# EAGLE design hector_monstertruck_shield (EAGLE 7.5.0)

## Sheet 1 of 2
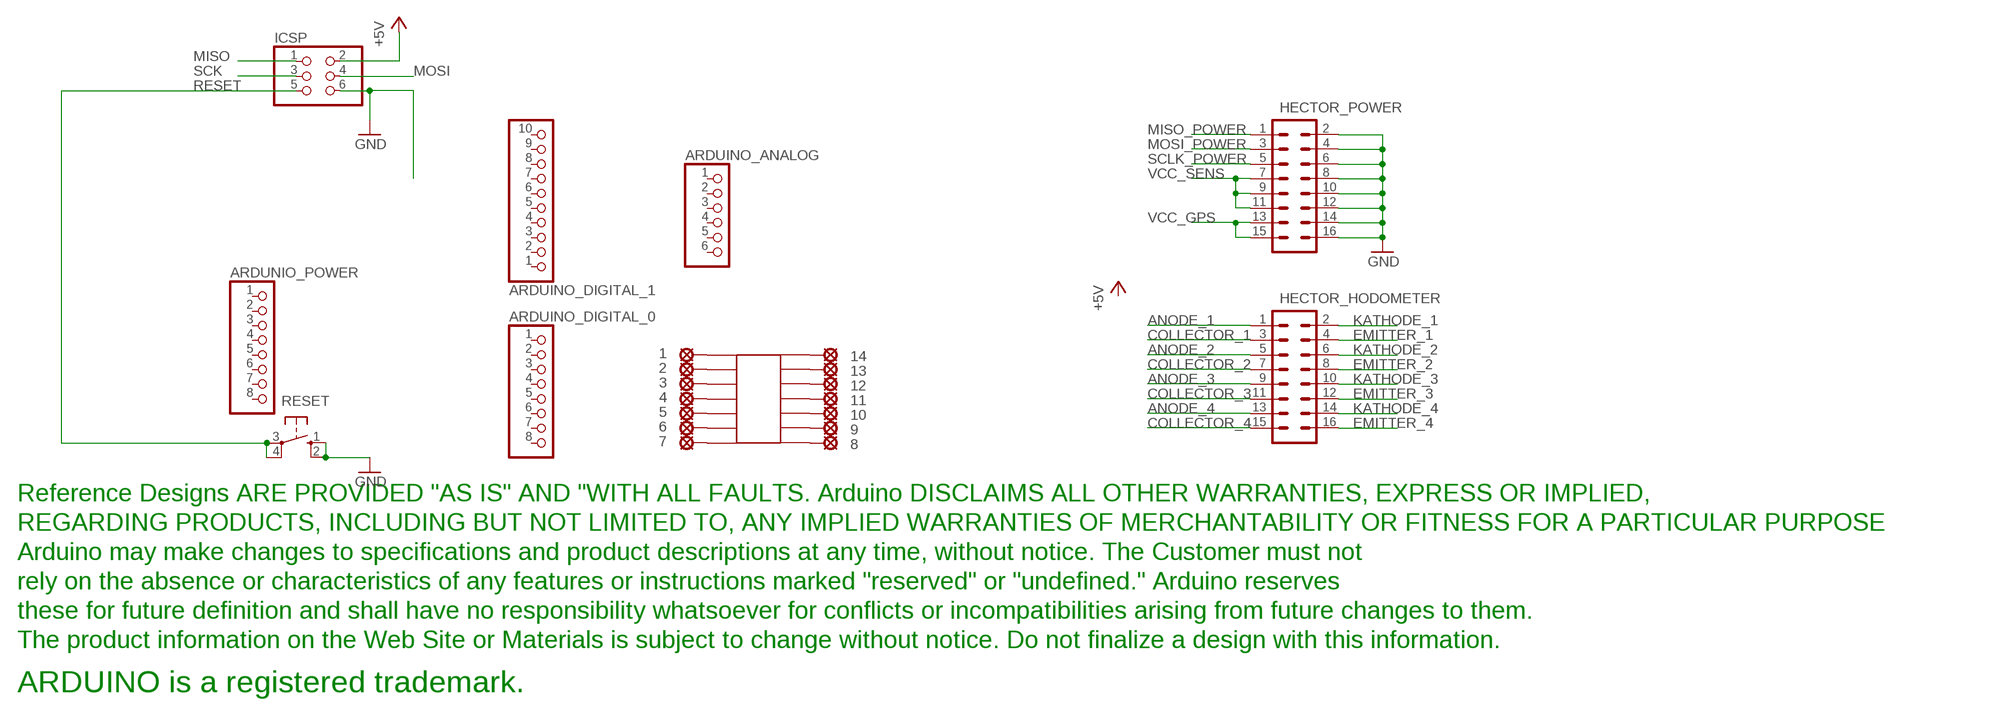
[diagram p0: schematic, sheet 1]

### Parts
1  LSP10  [LSP10]
2  LSP10  [LSP10]
3  LSP10  [LSP10]
4  LSP10  [LSP10]
5  LSP10  [LSP10]
6  LSP10  [LSP10]
7  LSP10  [LSP10]
8  LSP10  [LSP10]
9  LSP10  [LSP10]
10  LSP10  [LSP10]
11  LSP10  [LSP10]
12  LSP10  [LSP10]
13  LSP10  [LSP10]
14  LSP10  [LSP10]
ARDUINO_ANALOG  PINHD-1X6  [1X06]
ARDUINO_DIGITAL_0  PINHD-1X8TH  [1X08-TH]
ARDUINO_DIGITAL_1  PINHD-1X10TH  [1X10-TH]
ARDUNIO_POWER  PINHD-1X8TH  [1X08-TH]
HECTOR_HODOMETER  M08X2  [2X8]
HECTOR_POWER  M08X2  [2X8]
IC2  SMD-14  [SO-14NMW]
ICSP  PINHD-2X3  [2X03]
RESET  10-XX  [B3F-10XX]
U$1  DISCLAIMER  [DISCLAIMER]

### Nets
+5V: ICSP.2 ; also sheet 2
ANODE_1: HECTOR_HODOMETER.1
ANODE_2: HECTOR_HODOMETER.5
ANODE_3: HECTOR_HODOMETER.9
ANODE_4: HECTOR_HODOMETER.13
COLLECTOR_1: HECTOR_HODOMETER.3
COLLECTOR_2: HECTOR_HODOMETER.7
COLLECTOR_3: HECTOR_HODOMETER.11
COLLECTOR_4: HECTOR_HODOMETER.15
EMITTER_1: HECTOR_HODOMETER.4
EMITTER_2: HECTOR_HODOMETER.8
EMITTER_3: HECTOR_HODOMETER.12
EMITTER_4: HECTOR_HODOMETER.16
GND: HECTOR_POWER.2 HECTOR_POWER.4 HECTOR_POWER.6 HECTOR_POWER.8 HECTOR_POWER.10 HECTOR_POWER.12 HECTOR_POWER.14 HECTOR_POWER.16 ICSP.6 RESET.1(S) RESET.2(S1) ; also sheet 2
KATHODE_1: HECTOR_HODOMETER.2
KATHODE_2: HECTOR_HODOMETER.6
KATHODE_3: HECTOR_HODOMETER.10
KATHODE_4: HECTOR_HODOMETER.14
MISO: ICSP.1
MISO_POWER: HECTOR_POWER.1
MOSI: ICSP.4
MOSI_POWER: HECTOR_POWER.3
N$24: 14.MP IC2.P$14
N$97: 13.MP IC2.P$13
N$98: 12.MP IC2.P$12
N$99: 11.MP IC2.P$11
N$100: 10.MP IC2.P$10
N$101: 9.MP IC2.P$9
N$102: 8.MP IC2.P$8
N$103: 7.MP IC2.P$7
N$104: 6.MP IC2.P$6
N$109: 5.MP IC2.P$5
N$110: 3.MP IC2.P$3
N$111: 2.MP IC2.P$2
N$112: 1.MP IC2.P$1
N$113: 4.MP IC2.P$4
RESET: ICSP.5 RESET.3(P) RESET.4(P1)
SCK: ICSP.3
SCLK_POWER: HECTOR_POWER.5
VCC_GPS: HECTOR_POWER.13 HECTOR_POWER.15
VCC_SENS: HECTOR_POWER.7 HECTOR_POWER.9 HECTOR_POWER.11
Unconnected: ARDUINO_ANALOG.1 ARDUINO_ANALOG.2 ARDUINO_ANALOG.3 ARDUINO_ANALOG.4 ARDUINO_ANALOG.5 ARDUINO_ANALOG.6 ARDUINO_DIGITAL_0.1 ARDUINO_DIGITAL_0.2 ARDUINO_DIGITAL_0.3 ARDUINO_DIGITAL_0.4 ARDUINO_DIGITAL_0.5 ARDUINO_DIGITAL_0.6 ARDUINO_DIGITAL_0.7 ARDUINO_DIGITAL_0.8 ARDUINO_DIGITAL_1.1 ARDUINO_DIGITAL_1.2 ARDUINO_DIGITAL_1.3 ARDUINO_DIGITAL_1.4 ARDUINO_DIGITAL_1.5 ARDUINO_DIGITAL_1.6 ARDUINO_DIGITAL_1.7 ARDUINO_DIGITAL_1.8 ARDUINO_DIGITAL_1.9 ARDUINO_DIGITAL_1.10 ARDUNIO_POWER.1 ARDUNIO_POWER.2 ARDUNIO_POWER.3 ARDUNIO_POWER.4 ARDUNIO_POWER.5 ARDUNIO_POWER.6 ARDUNIO_POWER.7 ARDUNIO_POWER.8

## Sheet 2 of 2
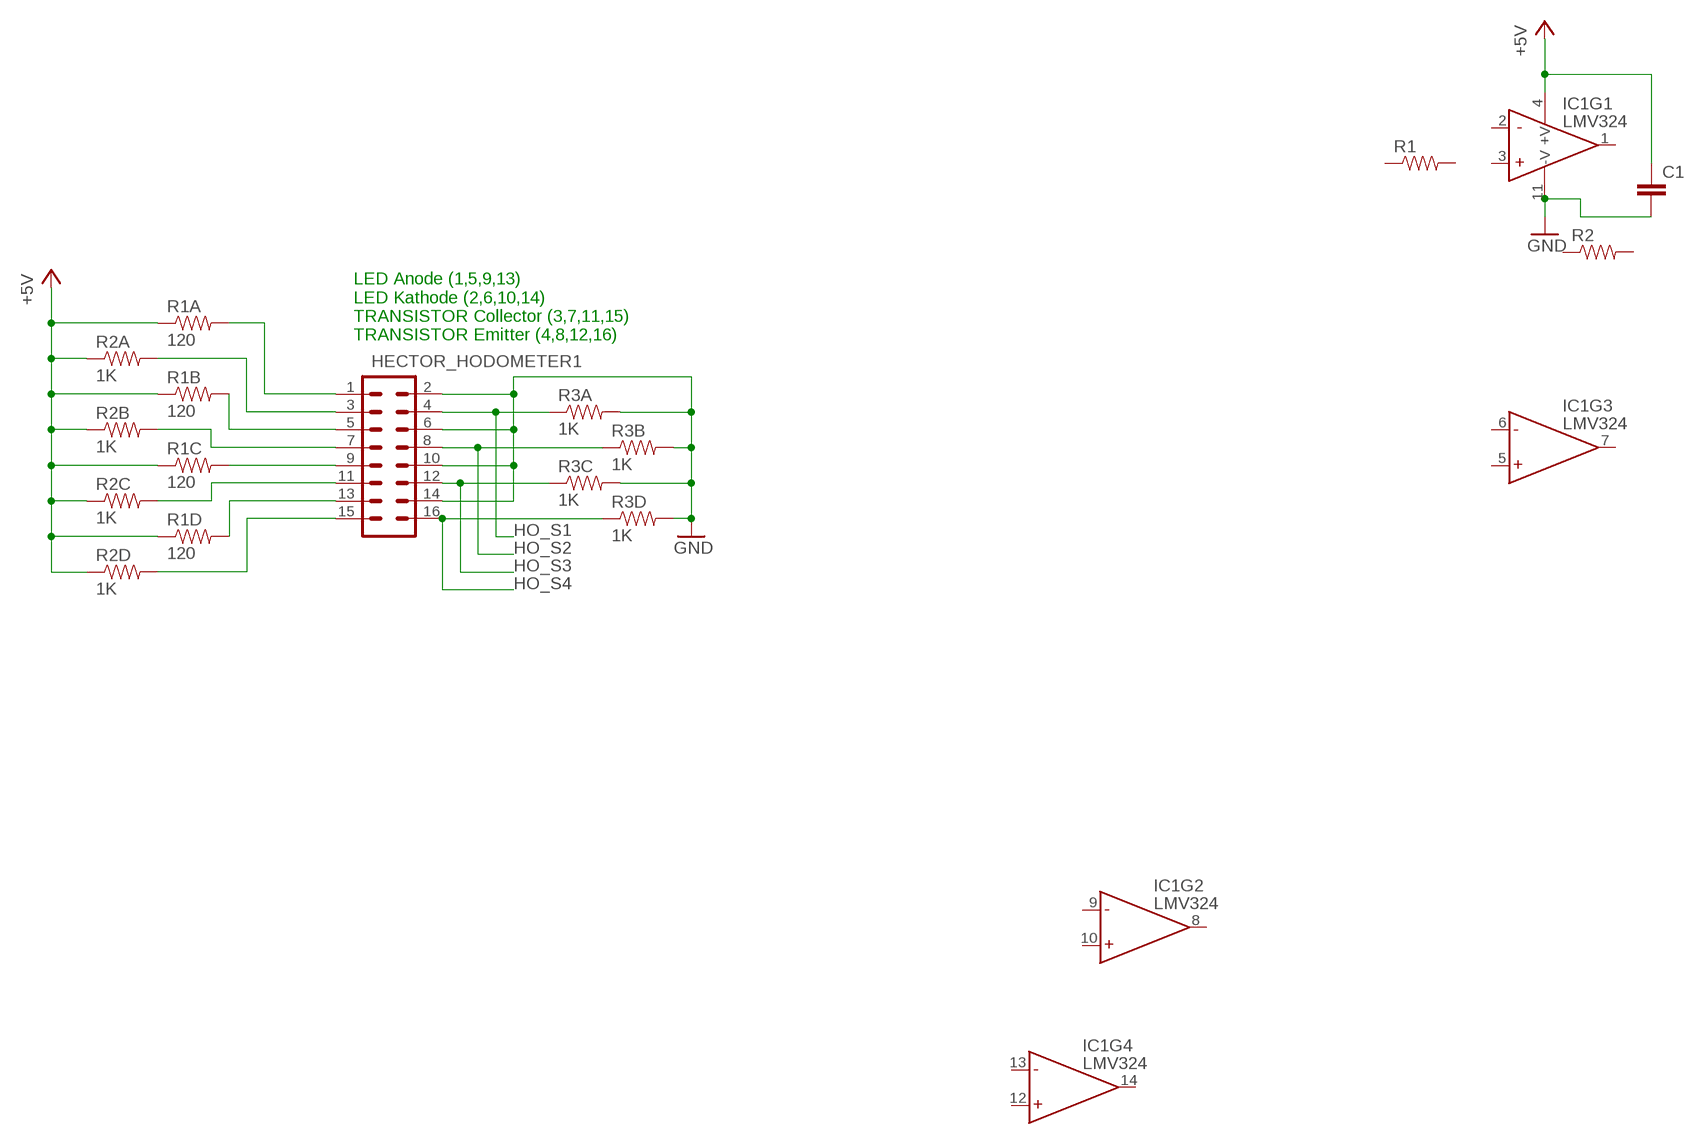
[diagram p1: schematic, sheet 2]

### Parts
C1  CAPPTH  [CAP-PTH-SMALL]
HECTOR_HODOMETER1  M08X2  [2X8]
IC1  LMV324  [SO014]
R1  RESISTORPTH-1/4W  [AXIAL-0.4]
R1A  120  RESISTORPTH-1/4W  [AXIAL-0.4]
R1B  120  RESISTORPTH-1/4W  [AXIAL-0.4]
R1C  120  RESISTORPTH-1/4W  [AXIAL-0.4]
R1D  120  RESISTORPTH-1/4W  [AXIAL-0.4]
R2  RESISTORPTH-1/4W  [AXIAL-0.4]
R2A  1K  RESISTORPTH-1/4W  [AXIAL-0.4]
R2B  1K  RESISTORPTH-1/4W  [AXIAL-0.4]
R2C  1K  RESISTORPTH-1/4W  [AXIAL-0.4]
R2D  1K  RESISTORPTH-1/4W  [AXIAL-0.4]
R3A  1K  RESISTORPTH-1/4W  [AXIAL-0.4]
R3B  1K  RESISTORPTH-1/4W  [AXIAL-0.4]
R3C  1K  RESISTORPTH-1/4W  [AXIAL-0.4]
R3D  1K  RESISTORPTH-1/4W  [AXIAL-0.4]

### Nets
+5V: C1.1 IC1.4(+V) R1A.P$1 R1B.P$1 R1C.P$1 R1D.P$1 R2A.P$1 R2B.P$1 R2C.P$1 R2D.P$1 ; also sheet 1
AN_1: HECTOR_HODOMETER1.1 R1A.P$2
AN_2: HECTOR_HODOMETER1.5 R1B.P$2
AN_3: HECTOR_HODOMETER1.9 R1C.P$2
AN_4: HECTOR_HODOMETER1.13 R1D.P$2
CO_1: HECTOR_HODOMETER1.3 R2A.P$2
CO_2: HECTOR_HODOMETER1.7 R2B.P$2
CO_3: HECTOR_HODOMETER1.11 R2C.P$2
CO_4: HECTOR_HODOMETER1.15 R2D.P$2
GND: C1.2 HECTOR_HODOMETER1.2 HECTOR_HODOMETER1.6 HECTOR_HODOMETER1.10 HECTOR_HODOMETER1.14 IC1.11(-V) R3A.P$2 R3B.P$2 R3C.P$2 R3D.P$2 ; also sheet 1
HO_S1: HECTOR_HODOMETER1.4 R3A.P$1
HO_S2: HECTOR_HODOMETER1.8 R3B.P$1
HO_S3: HECTOR_HODOMETER1.12 R3C.P$1
HO_S4: HECTOR_HODOMETER1.16 R3D.P$1
Unconnected: IC1.1(OUT) IC1.2(-IN) IC1.3(+IN) IC1.5(+IN) IC1.6(-IN) IC1.7(OUT) IC1.8(OUT) IC1.9(-IN) IC1.10(+IN) IC1.12(+IN) IC1.13(-IN) IC1.14(OUT) R1.P$1 R1.P$2 R2.P$1 R2.P$2

### Notes on the sheet
- LED Anode (1,5,9,13) 
  LED Kathode (2,6,10,14)
  TRANSISTOR Collector (3,7,11,15)
  TRANSISTOR Emitter (4,8,12,16)

## Library data of the parts
1-14 = SmartPrj:LSP10: SOLDER PAD drill 1.0 mm, distributor Buerklin, 12H555
ARDUINO_ANALOG = pinhead:PINHD-1X6: PIN HEADER
ARDUINO_DIGITAL_0 ARDUNIO_POWER = SmartPrj:PINHD-1X8: PIN HEADER
ARDUINO_DIGITAL_1 = SmartPrj:PINHD-1X10: PIN HEADER
C1 = SparkFun-Capacitors:CAP: Capacitor Standard 0603 ceramic capacitor, and 0.1" leaded capacitor.
HECTOR_HODOMETER HECTOR_HODOMETER1 HECTOR_POWER = SparkFun-Connectors:M08X2: .1" headers, two rows of 8 each
IC1 = SparkFun-AnalogIC:LMV324: Jellybean quad op-amp; PROD_ID: IC-08227
IC2 = carduino:SMD-14
ICSP = SmartPrj:PINHD-2X3: PIN HEADER
R1 R1A R1B R1C R1D R2 R2A R2B R2C R2D R3A R3B R3C R3D = SparkFun-Resistors:RESISTOR: Resistor Basic schematic elements and footprints for 0603, 1206, and PTH resistors.
RESET = switch-omron:10-XX: OMRON SWITCH
U$1 = SmartPrj:DISCLAIMER

## Board
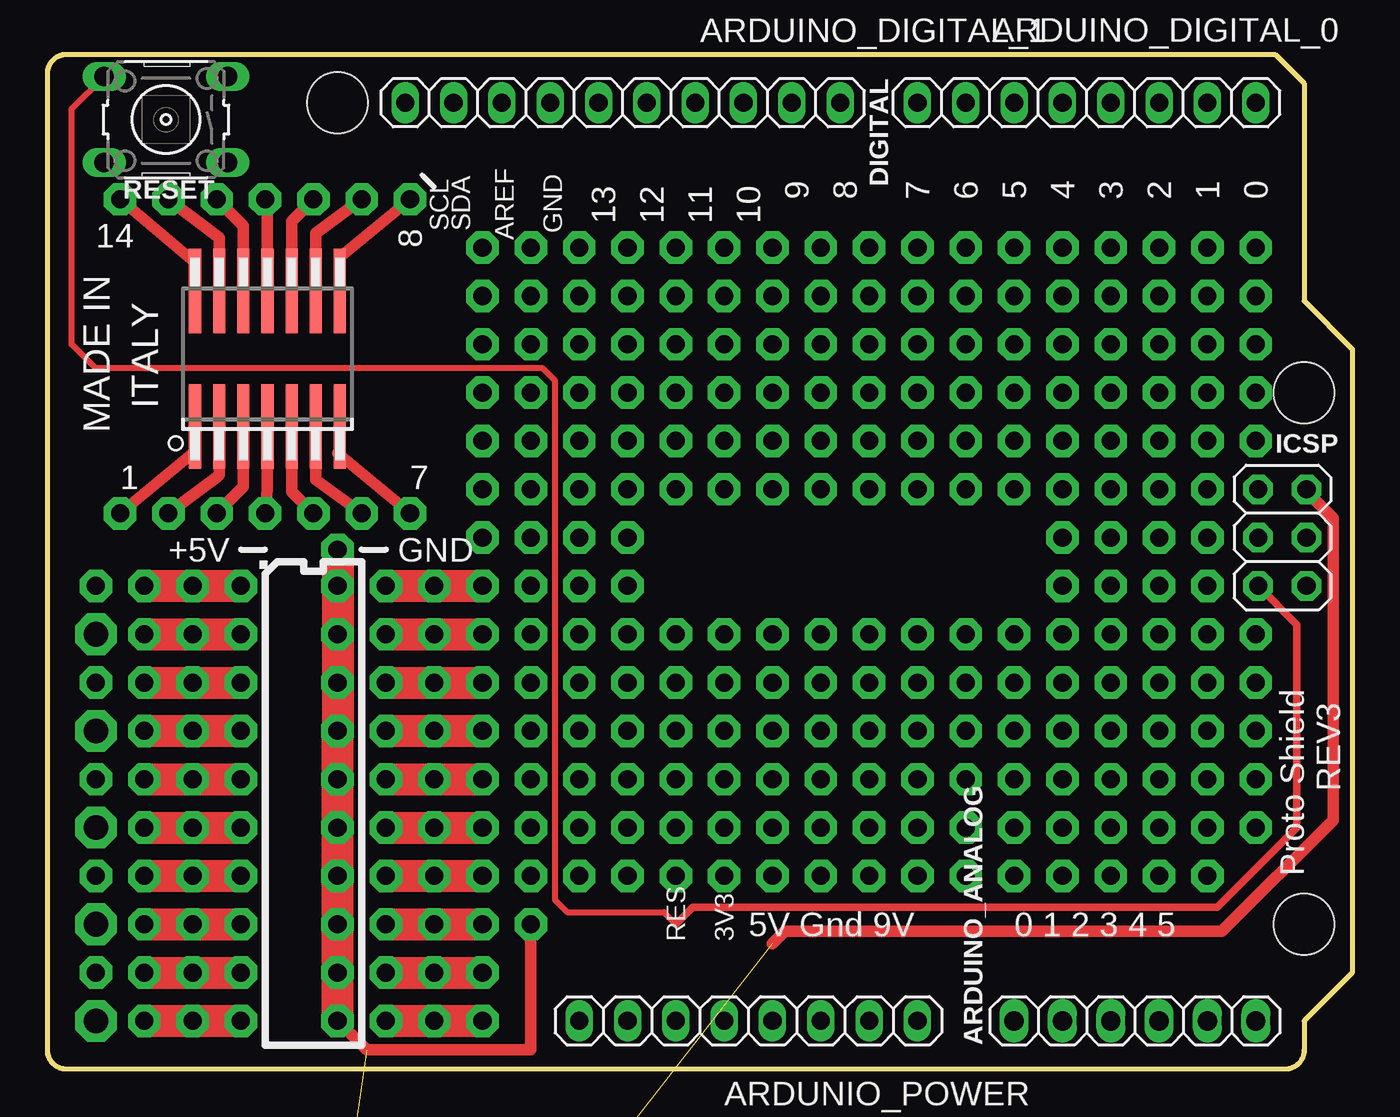
[diagram p2: board, top side]
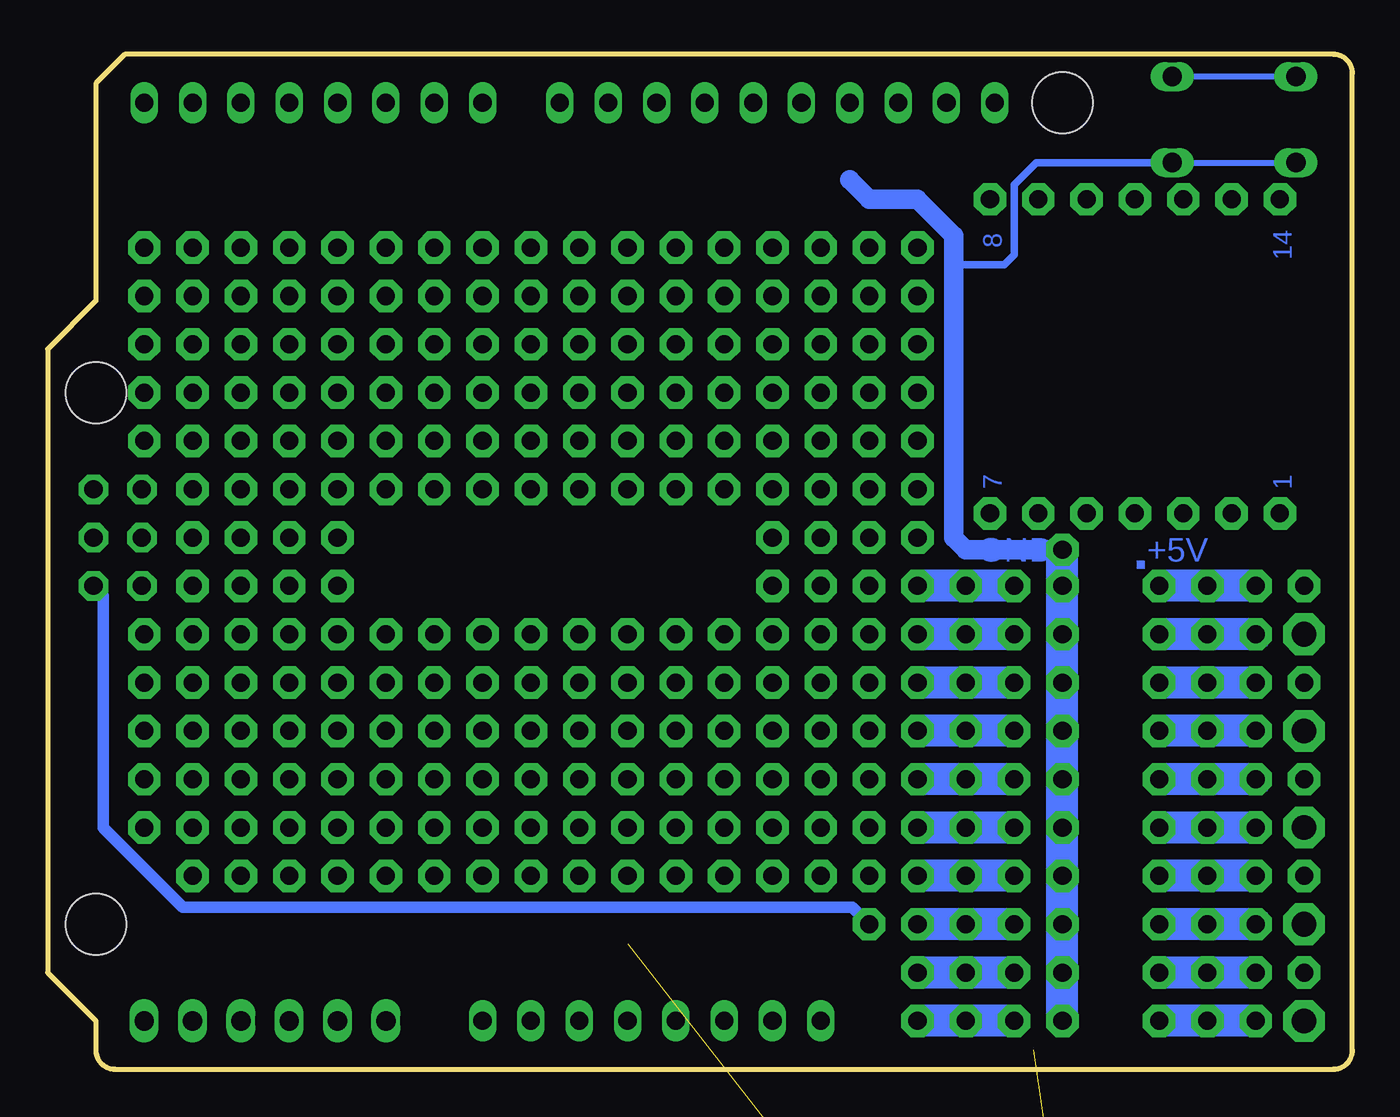
[diagram p3: board, bottom side, seen from below]

Size 68.58 x 53.34 mm. Coordinates in mm from the lower left corner, seen from the top.
Outline: 64.52,53.34 66.04,51.82 66.04,40.39 68.58,37.85 68.58,5.08 66.04,2.54 66.04,1 arc-90 65.04,0 1,0 arc-90 0,1 0,52.34 arc-90 1,53.34 64.52,53.34
Copper layers (1*16): Top 0.035mm / dielectric 1.5mm / Bottom 0.035mm
Design rules "default": minimum track width 10mil, minimum drill 24mil, track to track 8mil, track to pad 8mil, pad to pad 8mil, via to via 8mil, smd to smd 8mil, copper to edge 40mil, drill to drill 8mil, minimum pad ring 10mil, minimum via ring 8mil, stop-mask expansion 2mil, vias tented up to drill 0mil, thermal gap 10mil
Holes 3.2 mm at 15.24,50.8 66.04,7.62 66.04,35.56

### Footprints (pad centres in the part's own frame; a part is rotated, then mirrored left to right if it is on the bottom)
LSP10 = drill 0.95 pad 1.7 octagon: MP 0,0
1X06 = drill 1.016 long: 1 -6.35,0; 2 -3.81,0; 3 -1.27,0; 4 1.27,0; 5 3.81,0; 6 6.35,0
1X08-TH = drill 0.95 pad 1.422 long: 1 -8.89,0; 2 -6.35,0; 3 -3.81,0; 4 -1.27,0; 5 1.27,0; 6 3.81,0; 7 6.35,0; 8 8.89,0
1X10-TH = drill 0.95 pad 1.422 long: 1 -11.43,0; 2 -8.89,0; 3 -6.35,0; 4 -3.81,0; 5 -1.27,0; 6 1.27,0; 7 3.81,0; 8 6.35,0; 9 8.89,0; 10 11.43,0
CAP-PTH-SMALL = drill 0.7 pad 1.651: 1 0,0; 2 2.54,0
2X8 = drill 1.016 pad 1.88 octagon: 1 0,0; 2 0,2.54; 3 2.54,0; 4 2.54,2.54; 5 5.08,0; 6 5.08,2.54; 7 7.62,0; 8 7.62,2.54; 9 10.16,0; 10 10.16,2.54; 11 12.7,0; 12 12.7,2.54; 13 15.24,0; 14 15.24,2.54; 15 17.78,0; 16 17.78,2.54
SO014 = smd 0.6 x 1.2: 1 -3.175,-2.8; 2 -1.905,-2.8; 3 -0.635,-2.8; 4 0.635,-2.8; 5 1.905,-2.8; 6 3.175,-2.8; 7 4.445,-2.8; 8 4.445,2.8; 9 3.175,2.8; 10 1.905,2.8; 11 0.635,2.8; 12 -0.635,2.8; 13 -1.905,2.8; 14 -3.175,2.8
SO-14NMW = smd 0.635 x 4.445: P$1 -3.048,-3.683; P$2 -1.778,-3.683; P$3 -0.508,-3.683; P$4 0.762,-3.683; P$5 2.032,-3.683; P$6 3.302,-3.683; P$7 4.572,-3.683; P$8 4.572,3.429; P$9 3.302,3.429; P$10 2.032,3.429; P$11 0.762,3.429; P$12 -0.508,3.429; P$13 -1.778,3.429; P$14 -3.048,3.429
2X03 = drill 0.95 pad 1.55 octagon: 1 -2.54,-1.27; 2 -2.54,1.27; 3 0,-1.27; 4 0,1.27; 5 2.54,-1.27; 6 2.54,1.27
AXIAL-0.4 = drill 0.9 pad 1.88: P$1 -5.08,0; P$2 5.08,0
B3F-10XX = drill 1.016 long: 1 -3.251,2.261; 2 3.251,2.261; 3 -3.251,-2.261; 4 3.251,-2.261

### Placement (x,y rotation side)
1  3.81,29.21 90 top
2  6.35,29.21 90 top
3  8.89,29.21 90 top
4  11.43,29.21 90 top
5  13.97,29.21 90 top
6  16.51,29.21 90 top
7  19.05,29.21 90 top
8  19.05,45.72 90 top
9  16.51,45.72 90 top
10  13.97,45.72 90 top
11  11.43,45.72 90 top
12  8.89,45.72 90 top
13  6.35,45.72 270 top
14  3.81,45.72 270 top
ARDUINO_ANALOG  57.15,2.54 0 top
ARDUINO_DIGITAL_0  54.61,50.8 180 top
ARDUINO_DIGITAL_1  30.23,50.8 180 top
ARDUNIO_POWER  36.83,2.54 0 top
C1  -5.84,-116.71 0 top  (outside the outline)
HECTOR_HODOMETER  -5.21,-37.85 0 top  (outside the outline)
HECTOR_HODOMETER1  -5.21,-45.34 0 top  (outside the outline)
HECTOR_POWER  -5.21,-30.35 0 top  (outside the outline)
IC1  -0.89,-102.74 0 top  (outside the outline)
IC2  10.79,37.47 0 top
ICSP  64.9,27.94 270 top
R1  -0.76,-109.22 0 top  (outside the outline)
R1A  -0.76,-49.78 0 top  (outside the outline)
R1B  -0.76,-54.1 0 top  (outside the outline)
R1C  -0.76,-58.42 0 top  (outside the outline)
R1D  -0.76,-62.74 0 top  (outside the outline)
R2  -0.76,-113.54 0 top  (outside the outline)
R2A  -0.76,-67.06 0 top  (outside the outline)
R2B  -0.76,-71.37 0 top  (outside the outline)
R2C  -0.76,-75.69 0 top  (outside the outline)
R2D  -0.76,-80.01 0 top  (outside the outline)
R3A  -0.76,-84.33 0 top  (outside the outline)
R3B  -0.76,-88.65 0 top  (outside the outline)
R3C  -0.76,-92.96 0 top  (outside the outline)
R3D  -0.76,-97.28 0 top  (outside the outline)
RESET  6.22,49.91 180 top
U$1  -5.97,-23.11 0 top  (outside the outline)

### Tracks (layer width: path | path; a pad name or v marks a point on that pad's centre or on a via)
+5V  (10 unrouted)
  Top 0.61: ICSP.2 66.17,30.35 67.56,28.96 67.56,13.08 61.72,7.24 38.73,7.24 38.1,6.6
AN_1  (1 unrouted)
AN_2  (1 unrouted)
AN_3  (1 unrouted)
AN_4  (1 unrouted)
CO_1  (1 unrouted)
CO_2  (1 unrouted)
CO_3  (1 unrouted)
CO_4  (1 unrouted)
GND  (via drill 0.95 pad 1.7)  (18 unrouted)
  Top 0.61: v15.24,2.54 16.76,1.02 25.4,1.02 v25.4,7.62
  Top 1.676: v15.24,2.54 v15.24,5.08 v15.24,7.62 v15.24,10.16 v15.24,12.7 v15.24,15.24 v15.24,17.78 v15.24,20.32 v15.24,22.86 v15.24,25.4 v15.24,27.3
  Bottom 0.305: RESET.1 RESET.2
  Bottom 0.406: RESET.1 16.61,47.65 17.78,46.48 17.78,42.8 18.29,42.29 20.95,42.29
  Bottom 0.61: v25.4,7.62 26.29,8.51 43.18,8.51 61.47,8.51 65.66,12.7 65.66,24.89 ICSP.6
  Bottom 1.016: 26.42,46.74 25.4,45.72 22.86,45.72 20.95,43.81 20.95,42.29 20.95,27.94 20.32,27.3 v15.24,27.3
  Bottom 1.676: v15.24,2.54 v15.24,27.3
HO_S1  (1 unrouted)
HO_S2  (1 unrouted)
HO_S3  (1 unrouted)
HO_S4  (1 unrouted)
N$16  (via drill 0.95 pad 1.7)
  other vias: 50.8,30.48
N$17  (via drill 0.95 pad 1.7)
  other vias: 53.34,22.86
N$24
  Top 0.61: IC2.P$14 7.75,42.42 14.MP
N$26  (via drill 0.95 pad 1.7)
  other vias: 53.34,27.94
N$27  (via drill 0.95 pad 1.7)
  Top 1.676: v17.78,5.08 v22.86,5.08
N$28  (via drill 0.95 pad 1.7)
  other vias: 20.32,5.08
N$29  (via drill 1.3 pad 2.18)
  other vias: 2.54,17.78
N$30  (via drill 0.95 pad 1.7)
  other vias: 2.54,25.4
N$33  (via drill 0.95 pad 1.7)
  other vias: 7.62,5.08
N$34  (via drill 0.95 pad 1.7)
  Top 1.676: v5.08,5.08 v10.16,5.08
N$35  (via drill 1.3 pad 2.18)
  other vias: 2.54,22.86
N$36  (via drill 0.95 pad 1.7)
  other vias: 20.32,7.62
N$37  (via drill 0.95 pad 1.7)
  Top 1.676: v17.78,7.62 v22.86,7.62
N$38  (via drill 0.95 pad 1.7)
  other vias: 55.88,27.94
N$39  (via drill 0.95 pad 1.7)
  other vias: 58.42,30.48
N$40  (via drill 0.95 pad 1.7)
  other vias: 2.54,5.08
N$41  (via drill 0.95 pad 1.7)
  Top 1.676: v5.08,7.62 v10.16,7.62
N$42  (via drill 0.95 pad 1.7)
  other vias: 7.62,7.62
N$43  (via drill 0.95 pad 1.7)
  other vias: 58.42,27.94
N$44  (via drill 1.3 pad 2.18)
  other vias: 2.54,7.62
N$45  (via drill 0.95 pad 1.7)
  other vias: 45.72,10.16
N$46  (via drill 0.95 pad 1.7)
  other vias: 27.94,10.16
N$47  (via drill 0.95 pad 1.7)
  other vias: 25.4,10.16
N$48  (via drill 0.95 pad 1.7)
  Top 1.676: v17.78,10.16 v22.86,10.16
N$49  (via drill 0.95 pad 1.7)
  other vias: 20.32,10.16
N$50  (via drill 0.95 pad 1.7)
  other vias: 55.88,25.4
N$51  (via drill 0.95 pad 1.7)
  other vias: 58.42,25.4
N$52  (via drill 0.95 pad 1.7)
  other vias: 55.88,22.86
N$53  (via drill 0.95 pad 1.7)
  other vias: 53.34,25.4
N$54  (via drill 0.95 pad 1.7)
  other vias: 7.62,10.16
N$55  (via drill 0.95 pad 1.7)
  Top 1.676: v5.08,10.16 v10.16,10.16
N$56  (via drill 0.95 pad 1.7)
  other vias: 2.54,10.16
N$57  (via drill 0.95 pad 1.7)
  other vias: 53.34,12.7
N$58  (via drill 0.95 pad 1.7)
  other vias: 27.94,12.7
N$59  (via drill 0.95 pad 1.7)
  other vias: 25.4,12.7
N$60
  Bottom 1.676: 17.78,5.08 22.86,5.08
N$61  (via drill 0.95 pad 1.7)
  other vias: 20.32,12.7
N$62  (via drill 0.95 pad 1.7)
  Top 1.676: v17.78,12.7 v22.86,12.7
N$63  (via drill 0.95 pad 1.7)
  other vias: 22.86,27.94
N$64  (via drill 0.95 pad 1.7)
  other vias: 22.86,30.48
N$65  (via drill 0.95 pad 1.7)
  Top 1.676: v5.08,12.7 v10.16,12.7
N$66  (via drill 0.95 pad 1.7)
  other vias: 7.62,12.7
N$67  (via drill 0.95 pad 1.7)
  Top 1.676: v5.08,22.86 v10.16,22.86
N$68  (via drill 1.3 pad 2.18)
  other vias: 2.54,12.7
N$69  (via drill 0.95 pad 1.7)
  other vias: 43.18,15.24
N$70  (via drill 0.95 pad 1.7)
  other vias: 27.94,15.24
N$71  (via drill 0.95 pad 1.7)
  other vias: 25.4,15.24
N$72  (via drill 0.95 pad 1.7)
  Top 1.676: v17.78,15.24 v22.86,15.24
N$73  (via drill 0.95 pad 1.7)
  other vias: 20.32,15.24
N$74  (via drill 0.95 pad 1.7)
  other vias: 7.62,22.86
N$75  (via drill 0.95 pad 1.7)
  other vias: 7.62,20.32
N$76  (via drill 0.95 pad 1.7)
  Top 1.676: v22.86,22.86 v20.32,22.86 v17.78,22.86
N$77  (via drill 0.95 pad 1.7)
  Top 1.676: v22.86,20.32 v20.32,20.32 v17.78,20.32
N$78  (via drill 0.95 pad 1.7)
  other vias: 7.62,15.24
N$79  (via drill 0.95 pad 1.7)
  Top 1.676: v5.08,15.24 v10.16,15.24
N$80  (via drill 0.95 pad 1.7)
  other vias: 2.54,15.24
N$81  (via drill 0.95 pad 1.7)
  other vias: 58.42,17.78
N$82  (via drill 0.95 pad 1.7)
  other vias: 27.94,17.78
N$83  (via drill 0.95 pad 1.7)
  other vias: 25.4,17.78
N$84  (via drill 0.95 pad 1.7)
  Top 1.676: v5.08,17.78 v10.16,17.78
N$85  (via drill 0.95 pad 1.7)
  other vias: 20.32,17.78
N$86  (via drill 0.95 pad 1.7)
  Top 1.676: v17.78,17.78 v22.86,17.78
N$87  (via drill 0.95 pad 1.7)
  Top 1.676: v5.08,20.32 v10.16,20.32
N$88  (via drill 0.95 pad 1.7)
  other vias: 22.86,33.02
N$89  (via drill 0.95 pad 1.7)
  other vias: 22.86,35.56
N$90  (via drill 0.95 pad 1.7)
  other vias: 7.62,17.78
N$91  (via drill 0.95 pad 1.7)
  other vias: 22.86,38.1
N$92  (via drill 0.95 pad 1.7)
  other vias: 2.54,20.32
N$93  (via drill 0.95 pad 1.7)
  other vias: 60.96,20.32
N$94  (via drill 0.95 pad 1.7)
  other vias: 27.94,20.32
N$95  (via drill 0.95 pad 1.7)
  other vias: 25.4,20.32
N$96  (via drill 0.95 pad 1.7)
  other vias: 22.86,40.64
N$97
  Top 0.61: IC2.P$13 9.02,43.69 13.MP
N$98
  Top 0.61: IC2.P$12 10.29,44.32 12.MP
N$99
  Top 0.61: IC2.P$11 11.56,46.23 11.MP
N$100
  Top 0.61: IC2.P$10 12.83,44.58 10.MP
N$101
  Top 0.61: IC2.P$9 14.1,43.94 9.MP
N$102
  Top 0.61: IC2.P$8 15.37,42.67 8.MP
N$103
  Top 0.61: 7.MP 15.24,32.38 15.37,32.51 IC2.P$7
N$104
  Top 0.61: IC2.P$6 14.1,30.99 6.MP
N$105  (via drill 0.95 pad 1.7)
  other vias: 63.5,22.86
N$106  (via drill 0.95 pad 1.7)
  other vias: 27.94,22.86
N$107  (via drill 0.95 pad 1.7)
  other vias: 25.4,22.86
N$108  (via drill 0.95 pad 1.7)
  other vias: 22.86,43.18
N$109
  Top 0.61: IC2.P$5 12.83,30.35 5.MP
N$110
  Top 0.61: IC2.P$3 10.29,30.61 3.MP
N$111
  Top 0.61: 2.MP 8.89,31.11 9.02,31.24 IC2.P$2
N$112
  Top 0.61: 1.MP 7.62,32.38 7.75,32.51 IC2.P$1
N$113
  Top 0.61: IC2.P$4 11.56,30.48 4.MP
N$114
  Bottom 1.676: 5.08,25.4 10.16,25.4
N$115
  Bottom 1.676: 17.78,25.4 22.86,25.4
N$116
  Bottom 1.676: 17.78,22.86 22.86,22.86
N$117  (via drill 0.95 pad 1.7)
  other vias: 60.96,25.4
N$118  (via drill 0.95 pad 1.7)
  Top 1.676: v22.86,25.4 v20.32,25.4 v17.78,25.4
N$119  (via drill 0.95 pad 1.7)
  other vias: 27.94,25.4
N$120  (via drill 0.95 pad 1.7)
  other vias: 25.4,25.4
N$121
  Bottom 1.676: 17.78,20.32 22.86,20.32
N$122
  Bottom 1.676: 17.78,17.78 22.86,17.78
N$123  (via drill 0.95 pad 1.7)
  other vias: 25.4,43.18
N$124
  Bottom 1.676: 17.78,15.24 22.86,15.24
N$125
  Bottom 1.676: 17.78,12.7 22.86,12.7
N$126
  Bottom 1.676: 17.78,10.16 22.86,10.16
N$127
  Bottom 1.676: 5.08,5.08 10.16,5.08
N$128
  Bottom 1.676: 5.08,10.16 10.16,10.16
N$129
  Bottom 1.676: 5.08,12.7 10.16,12.7
N$130
  Bottom 1.676: 5.08,15.24 10.16,15.24
N$131  (via drill 0.95 pad 1.7)
  other vias: 27.94,27.94
N$132  (via drill 0.95 pad 1.7)
  other vias: 25.4,27.94
N$133
  Bottom 1.676: 5.08,17.78 10.16,17.78
N$134
  Bottom 1.676: 5.08,20.32 10.16,20.32
N$135  (via drill 0.95 pad 1.7)
  other vias: 25.4,30.48
N$136
  Bottom 1.676: 5.08,22.86 10.16,22.86
N$137
  Bottom 1.676: 5.08,7.62 10.16,7.62
N$138
  Bottom 1.676: 5.08,2.54 10.16,2.54
N$139
  Bottom 1.676: 17.78,7.62 22.86,7.62
N$140
  Bottom 1.676: 17.78,2.54 22.86,2.54
N$143  (via drill 0.95 pad 1.7)
  other vias: 27.94,30.48
N$153  (via drill 0.95 pad 1.7)
  other vias: 55.88,33.02
N$155  (via drill 0.95 pad 1.7)
  other vias: 27.94,33.02
N$156  (via drill 0.95 pad 1.7)
  other vias: 25.4,33.02
N$165  (via drill 0.95 pad 1.7)
  other vias: 50.8,35.56
N$167  (via drill 0.95 pad 1.7)
  other vias: 27.94,35.56
N$168  (via drill 0.95 pad 1.7)
  other vias: 25.4,35.56
N$177  (via drill 0.95 pad 1.7)
  other vias: 43.18,38.1
N$178  (via drill 0.95 pad 1.7)
  Top 1.676: v5.08,25.4 v10.16,25.4
N$179  (via drill 0.95 pad 1.7)
  other vias: 27.94,38.1
N$180  (via drill 0.95 pad 1.7)
  other vias: 25.4,38.1
N$189  (via drill 0.95 pad 1.7)
  other vias: 63.5,40.64
N$190  (via drill 0.95 pad 1.7)
  other vias: 7.62,25.4
N$191  (via drill 0.95 pad 1.7)
  other vias: 27.94,40.64
N$192  (via drill 0.95 pad 1.7)
  other vias: 25.4,40.64
N$201  (via drill 0.95 pad 1.7)
  other vias: 38.1,43.18
N$203  (via drill 0.95 pad 1.7)
  other vias: 27.94,43.18
N$227  (via drill 0.95 pad 1.7)
  other vias: 30.48,38.1
N$228  (via drill 0.95 pad 1.7)
  other vias: 33.02,38.1
N$229  (via drill 0.95 pad 1.7)
  other vias: 30.48,35.56
N$230  (via drill 0.95 pad 1.7)
  other vias: 33.02,35.56
N$231  (via drill 0.95 pad 1.7)
  other vias: 30.48,33.02
N$232  (via drill 0.95 pad 1.7)
  other vias: 33.02,33.02
N$233  (via drill 0.95 pad 1.7)
  other vias: 35.56,35.56
N$234  (via drill 0.95 pad 1.7)
  other vias: 35.56,33.02
N$235  (via drill 0.95 pad 1.7)
  other vias: 33.02,30.48
N$236  (via drill 0.95 pad 1.7)
  other vias: 35.56,30.48
N$237  (via drill 0.95 pad 1.7)
  other vias: 38.1,33.02
N$238  (via drill 0.95 pad 1.7)
  other vias: 38.1,35.56
N$239  (via drill 0.95 pad 1.7)
  other vias: 38.1,30.48
N$240  (via drill 0.95 pad 1.7)
  other vias: 40.64,33.02
N$241  (via drill 0.95 pad 1.7)
  other vias: 40.64,35.56
N$242  (via drill 0.95 pad 1.7)
  other vias: 38.1,38.1
N$243  (via drill 0.95 pad 1.7)
  other vias: 35.56,38.1
N$245  (via drill 0.95 pad 1.7)
  other vias: 33.02,40.64
N$246  (via drill 0.95 pad 1.7)
  other vias: 35.56,40.64
N$247  (via drill 0.95 pad 1.7)
  other vias: 30.48,40.64
N$248  (via drill 0.95 pad 1.7)
  other vias: 30.48,43.18
N$249  (via drill 0.95 pad 1.7)
  other vias: 33.02,43.18
N$251  (via drill 0.95 pad 1.7)
  other vias: 30.48,30.48
N$252  (via drill 0.95 pad 1.7)
  other vias: 30.48,27.94
N$259  (via drill 0.95 pad 1.7)
  other vias: 33.02,22.86
N$261  (via drill 0.95 pad 1.7)
  other vias: 35.56,22.86
N$262  (via drill 0.95 pad 1.7)
  other vias: 38.1,22.86
N$263  (via drill 0.95 pad 1.7)
  other vias: 40.64,22.86
N$267  (via drill 0.95 pad 1.7)
  other vias: 43.18,30.48
N$268  (via drill 0.95 pad 1.7)
  other vias: 40.64,30.48
N$269  (via drill 0.95 pad 1.7)
  other vias: 45.72,30.48
N$271  (via drill 0.95 pad 1.7)
  other vias: 30.48,25.4
N$272  (via drill 0.95 pad 1.7)
  other vias: 30.48,22.86
N$273  (via drill 0.95 pad 1.7)
  other vias: 30.48,20.32
N$274  (via drill 0.95 pad 1.7)
  other vias: 33.02,15.24
N$275  (via drill 0.95 pad 1.7)
  other vias: 33.02,17.78
N$276  (via drill 0.95 pad 1.7)
  other vias: 38.1,17.78
N$277  (via drill 0.95 pad 1.7)
  other vias: 35.56,17.78
N$278  (via drill 0.95 pad 1.7)
  other vias: 35.56,15.24
N$279  (via drill 0.95 pad 1.7)
  other vias: 30.48,15.24
N$280  (via drill 0.95 pad 1.7)
  other vias: 30.48,17.78
N$281  (via drill 0.95 pad 1.7)
  other vias: 38.1,20.32
N$282  (via drill 0.95 pad 1.7)
  other vias: 40.64,20.32
N$283  (via drill 0.95 pad 1.7)
  other vias: 38.1,15.24
N$284  (via drill 0.95 pad 1.7)
  other vias: 30.48,12.7
N$285  (via drill 0.95 pad 1.7)
  other vias: 33.02,12.7
N$286  (via drill 0.95 pad 1.7)
  other vias: 30.48,10.16
N$289  (via drill 0.95 pad 1.7)
  other vias: 33.02,10.16
N$290  (via drill 0.95 pad 1.7)
  other vias: 35.56,10.16
N$291  (via drill 0.95 pad 1.7)
  other vias: 35.56,12.7
N$292  (via drill 0.95 pad 1.7)
  other vias: 38.1,12.7
N$293  (via drill 0.95 pad 1.7)
  other vias: 40.64,17.78
N$294  (via drill 0.95 pad 1.7)
  other vias: 43.18,17.78
N$295  (via drill 0.95 pad 1.7)
  other vias: 43.18,20.32
N$296  (via drill 0.95 pad 1.7)
  other vias: 45.72,20.32
N$297  (via drill 0.95 pad 1.7)
  other vias: 45.72,22.86
N$298  (via drill 0.95 pad 1.7)
  other vias: 43.18,22.86
N$299  (via drill 0.95 pad 1.7)
  other vias: 48.26,22.86
N$304  (via drill 0.95 pad 1.7)
  other vias: 53.34,30.48
N$305  (via drill 0.95 pad 1.7)
  other vias: 48.26,30.48
N$307  (via drill 0.95 pad 1.7)
  other vias: 45.72,33.02
N$309  (via drill 0.95 pad 1.7)
  other vias: 50.8,33.02
N$310  (via drill 0.95 pad 1.7)
  other vias: 48.26,33.02
N$311  (via drill 0.95 pad 1.7)
  other vias: 43.18,33.02
N$312  (via drill 0.95 pad 1.7)
  other vias: 43.18,35.56
N$313  (via drill 0.95 pad 1.7)
  other vias: 45.72,35.56
N$314  (via drill 0.95 pad 1.7)
  other vias: 33.02,20.32
N$315  (via drill 0.95 pad 1.7)
  other vias: 35.56,20.32
N$316  (via drill 0.95 pad 1.7)
  other vias: 45.72,17.78
N$317  (via drill 0.95 pad 1.7)
  other vias: 48.26,20.32
N$318  (via drill 0.95 pad 1.7)
  other vias: 50.8,20.32
N$319  (via drill 0.95 pad 1.7)
  other vias: 50.8,22.86
N$320  (via drill 0.95 pad 1.7)
  other vias: 55.88,20.32
N$321  (via drill 0.95 pad 1.7)
  other vias: 63.5,20.32
N$322  (via drill 0.95 pad 1.7)
  other vias: 63.5,17.78
N$323  (via drill 0.95 pad 1.7)
  other vias: 60.96,17.78
N$324  (via drill 0.95 pad 1.7)
  other vias: 63.5,15.24
N$325  (via drill 0.95 pad 1.7)
  other vias: 63.5,12.7
N$326  (via drill 0.95 pad 1.7)
  other vias: 60.96,12.7
N$327  (via drill 0.95 pad 1.7)
  other vias: 58.42,12.7
N$329  (via drill 1.3 pad 2.18)
  other vias: 2.54,2.54
N$331  (via drill 0.95 pad 1.7)
  other vias: 7.62,2.54
N$332  (via drill 0.95 pad 1.7)
  Top 1.676: v5.08,2.54 v10.16,2.54
N$335  (via drill 0.95 pad 1.7)
  Top 1.676: v17.78,2.54 v22.86,2.54
N$336  (via drill 0.95 pad 1.7)
  other vias: 20.32,2.54
N$353  (via drill 0.95 pad 1.7)
  other vias: 60.96,10.16
N$354  (via drill 0.95 pad 1.7)
  other vias: 58.42,10.16
N$355  (via drill 0.95 pad 1.7)
  other vias: 55.88,10.16
N$356  (via drill 0.95 pad 1.7)
  other vias: 53.34,10.16
N$357  (via drill 0.95 pad 1.7)
  other vias: 50.8,10.16
N$358  (via drill 0.95 pad 1.7)
  other vias: 48.26,10.16
N$359  (via drill 0.95 pad 1.7)
  other vias: 40.64,10.16
N$360  (via drill 0.95 pad 1.7)
  other vias: 38.1,10.16
N$361  (via drill 0.95 pad 1.7)
  other vias: 43.18,10.16
N$362  (via drill 0.95 pad 1.7)
  other vias: 43.18,12.7
N$363  (via drill 0.95 pad 1.7)
  other vias: 40.64,12.7
N$364  (via drill 0.95 pad 1.7)
  other vias: 45.72,12.7
N$365  (via drill 0.95 pad 1.7)
  other vias: 48.26,12.7
N$366  (via drill 0.95 pad 1.7)
  other vias: 55.88,12.7
N$367  (via drill 0.95 pad 1.7)
  other vias: 50.8,12.7
N$368  (via drill 0.95 pad 1.7)
  other vias: 60.96,15.24
N$369  (via drill 0.95 pad 1.7)
  other vias: 58.42,15.24
N$370  (via drill 0.95 pad 1.7)
  other vias: 55.88,15.24
N$371  (via drill 0.95 pad 1.7)
  other vias: 53.34,15.24
N$372  (via drill 0.95 pad 1.7)
  other vias: 50.8,15.24
N$373  (via drill 0.95 pad 1.7)
  other vias: 48.26,15.24
N$374  (via drill 0.95 pad 1.7)
  other vias: 45.72,15.24
N$375  (via drill 0.95 pad 1.7)
  other vias: 40.64,15.24
N$376  (via drill 0.95 pad 1.7)
  other vias: 48.26,17.78
N$377  (via drill 0.95 pad 1.7)
  other vias: 50.8,17.78
N$378  (via drill 0.95 pad 1.7)
  other vias: 53.34,17.78
N$379  (via drill 0.95 pad 1.7)
  other vias: 55.88,17.78
N$380  (via drill 0.95 pad 1.7)
  other vias: 58.42,20.32
N$381  (via drill 0.95 pad 1.7)
  other vias: 53.34,20.32
N$383  (via drill 0.95 pad 1.7)
  other vias: 58.42,22.86
N$385  (via drill 0.95 pad 1.7)
  other vias: 60.96,22.86
N$393  (via drill 0.95 pad 1.7)
  other vias: 60.96,27.94
N$395  (via drill 0.95 pad 1.7)
  other vias: 55.88,30.48
N$396  (via drill 0.95 pad 1.7)
  other vias: 60.96,30.48
N$397  (via drill 0.95 pad 1.7)
  other vias: 63.5,33.02
N$398  (via drill 0.95 pad 1.7)
  other vias: 60.96,33.02
N$399  (via drill 0.95 pad 1.7)
  other vias: 58.42,33.02
N$400  (via drill 0.95 pad 1.7)
  other vias: 53.34,33.02
N$401  (via drill 0.95 pad 1.7)
  other vias: 63.5,35.56
N$402  (via drill 0.95 pad 1.7)
  other vias: 58.42,35.56
N$403  (via drill 0.95 pad 1.7)
  other vias: 60.96,35.56
N$404  (via drill 0.95 pad 1.7)
  other vias: 63.5,38.1
N$405  (via drill 0.95 pad 1.7)
  other vias: 60.96,38.1
N$406  (via drill 0.95 pad 1.7)
  other vias: 58.42,38.1
N$407  (via drill 0.95 pad 1.7)
  other vias: 55.88,38.1
N$408  (via drill 0.95 pad 1.7)
  other vias: 55.88,35.56
N$409  (via drill 0.95 pad 1.7)
  other vias: 53.34,38.1
N$410  (via drill 0.95 pad 1.7)
  other vias: 53.34,35.56
N$411  (via drill 0.95 pad 1.7)
  other vias: 48.26,35.56
N$412  (via drill 0.95 pad 1.7)
  other vias: 50.8,38.1
N$413  (via drill 0.95 pad 1.7)
  other vias: 48.26,38.1
N$414  (via drill 0.95 pad 1.7)
  other vias: 45.72,38.1
N$415  (via drill 0.95 pad 1.7)
  other vias: 40.64,38.1
N$416  (via drill 0.95 pad 1.7)
  other vias: 38.1,40.64
N$417  (via drill 0.95 pad 1.7)
  other vias: 43.18,40.64
N$418  (via drill 0.95 pad 1.7)
  other vias: 40.64,40.64
N$419  (via drill 0.95 pad 1.7)
  other vias: 45.72,40.64
N$420  (via drill 0.95 pad 1.7)
  other vias: 48.26,40.64
N$421  (via drill 0.95 pad 1.7)
  other vias: 50.8,40.64
N$422  (via drill 0.95 pad 1.7)
  other vias: 53.34,40.64
N$423  (via drill 0.95 pad 1.7)
  other vias: 55.88,40.64
N$424  (via drill 0.95 pad 1.7)
  other vias: 58.42,40.64
N$425  (via drill 0.95 pad 1.7)
  other vias: 60.96,40.64
N$426  (via drill 0.95 pad 1.7)
  other vias: 63.5,43.18
N$427  (via drill 0.95 pad 1.7)
  other vias: 60.96,43.18
N$428  (via drill 0.95 pad 1.7)
  other vias: 58.42,43.18
N$429  (via drill 0.95 pad 1.7)
  other vias: 55.88,43.18
N$430  (via drill 0.95 pad 1.7)
  other vias: 50.8,43.18
N$431  (via drill 0.95 pad 1.7)
  other vias: 53.34,43.18
N$432  (via drill 0.95 pad 1.7)
  other vias: 48.26,43.18
N$433  (via drill 0.95 pad 1.7)
  other vias: 45.72,43.18
N$434  (via drill 0.95 pad 1.7)
  other vias: 43.18,43.18
N$435  (via drill 0.95 pad 1.7)
  other vias: 40.64,43.18
N$436  (via drill 0.95 pad 1.7)
  other vias: 35.56,43.18
RESET
  Top 0.305: 33.02,7.62 32.38,8.26 27.3,8.26 26.67,8.89 26.67,36.2 26.04,36.83 2.54,36.83 1.27,38.1 1.27,50.47 RESET.4
  Top 0.406: 33.02,7.62 33.91,8.51 61.47,8.51 65.66,12.7 65.66,23.37 ICSP.5
  Bottom 0.305: RESET.4 RESET.3
VCC_GPS  (1 unrouted)
VCC_SENS  (2 unrouted)

### Text on the board
Bottom: 14 | 8 | 1 | 7 | +5V | GND | .
tPlace: 9 | 8 | 7 | 6 | 5 | 4 | 3 | 2 | 1 | 0 | 13 | 12 | 11 | 10 | +5V | GND | . | REV3 | Proto Shield
tNames: DIGITAL | AREF | SCL | SDA | GND | ITALY | MADE IN | RES | 3V3 | 5V Gnd 9V | 0 1 2 3 4 5
bStop: DIGITAL | SDA | AREF | SCL | GND | 13 | 12 | 11 | 9 | 8 | 7 | 6 | 5 | 4 | 3 | 2 | 1 | 0 | 10 | 14 | 8 | 1 | 7 | 1 | 2 | 3 | 4 | +5V | GND | . | 5 | 6 | IOREF | RST | 3.3V | 5V | GND | GND | VIN | ANALOG | 0 | 1 | 2 | 3 | 4 | 5
Reference: USB | ETH